# Altium project JST_LED.PrjPcb
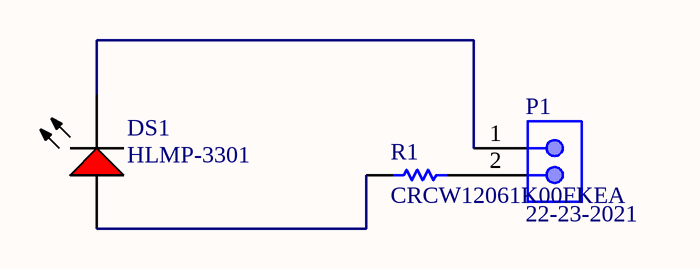
[diagram p0: JST_LED.SchDoc]
1 sheet, 3 parts. Net scope: global (net labels, ports and power ports of the same name join across sheets).
Board file: JST_LED.PcbDoc

## Sheet JST_LED.SchDoc
size A4

### Parts
DS1  HLMP-3301  [AVAG-HLMP-3301-2]
P1  22-23-2021  [MOLX-22-23-2021_V]
R1  CRCW12061K00FKEA  [RESC3216X60X45ML15T20]

### Nets
NetDS1_1: DS1.1(K) P1.1
NetDS1_2: DS1.2(A) R1.1
NetP1_2: P1.2 R1.2

### Library data of the parts
DS1 = CMP-2000-06411-1: T-1 3/4 (5 mm) Diffused LED Lamp, 1.9 V, -40 to 100 degC, 2-Pin THD, RoHS, Bulk; Manufacturer: Avago; Forward Current: 25mA; Forward Voltage: 2.4V; Peak Wavelength: 635nm; Shape Type: Circular; High Brightness: No; Main Category: StandardLED; Test Current (It): 10mA; Dominant Wave Length: 626nm; Number of  Elements: 1; Reverse Voltage: 5V; Chip Material: GaP; Product Height (mm): 9.19mm; Lens Type: ColoredDiffused; Viewing Angle: 60deg; Type: Uni-Color; Emitting Color: Red; Luminous Intensity: 5.4mcd; Power Dissipation: 85W; DELETED: Compliant; Product Depth (mm): 6.1mm; Package Description: 2-Pin Through Hole LED, Dia 5.85 mm; Mounting Technology: ThroughHole; Manufacturer URL: http://www.avagotech.com/; Package Type: T-13/4; Operating Temp Range: -40Cto100C; Datasheet URL: http://www.avagotech.com/docs/AV02-1558EN; Mounting: ThroughHole; Lens Dimensions: 5.08x5.08x8.3mm; Package Reference: HLMP-3301; Datasheet Version: 03/2015; Pin Count: 2; Packaging: TapeandReel; Operating Temperature Classification: Industrial; Lum Intensity: 5.4mcd; Rad Hardened: No; Product Length (mm): 6.1mm
P1 = CMP-1704-00001-3: Male Header, Pitch 2.54 mm, 1 x 2 Position, Height 10.67 mm, Tail Length 3.56 mm, 0 to 75 degC, RoHS, Bulk; Package Quantity: 3000; Height: 10.67 mm; RoHSCompliant: True; ComponentLink2URL: https://datasheet.ciiva.com/19454/232266-19454304.pdf; PartNumber: 22-23-2021; Packaging: Bulk; ComponentLink2Description: Datasheet; Min Operating Temperature: 0 degC; ComponentLink1Description: Manufacturer URL; Length: 5.08 mm; Mounting Technology: Through Hole; Max Operating Temperature: 75 degC; REACH SVHC: Unknown; PackageDescription: Male Header, Pitch 2.54 mm, 1 x 2 Position, Height 10.67 mm, Tail Length 3.56 mm; ComponentLink1URL: http://www.molex.com/; Mount: Through Hole; Radiation Hardening: No; Width: 6.35 mm; Pins: 2
R1 = CMP-2100-03616-1: Chip Resistor, 1 KOhm, +/- 1%, 0.25 W, -55 to 155 degC, 1206 (3216 Metric), RoHS, Tape and Reel; Manufacturer: Vishay Semiconductor; Power Rating: 250mW; Voltage Rating (DC): 200V; Resistance: 1KOhm; Temperature Coefficient: 100ppm/degreesC; Case Code (Imperial): 1206; Length: 3.2mm; Case/Package: 1206; Contact Plating: Tin; Package Quantity: 10; Datasheet URL: http://www.farnell.com/datasheets/1720486.pdf; Mount: SurfaceMount; Package Description: 2-Pin Surface Mount Device, Body 3.15 x 1.6 mm; Package Reference: 1206.0; Max Operating Temperature: 155degC; Lead Free: LeadFree; Weight: 0.000353oz; Military Standard: Not; Max Power Dissipation: 250mW; Case Code (Metric): 3216; Number of Terminations: 2; Tolerance: 1%; Width: 0.063inch; Termination: SMD/SMT; Number of Pins: 2; Min Operating Temperature: -55degC; Height: 0.55mm; Depth: 1.6mm; RoHSCompliant: true; Composition: ThickFilm; Packaging: TapeandReel; Manufacturer URL: http://www.vishay.com/; Voltage Rating: 200V; Radiation Hardening: No; REACH SVHC: Unknown; Datasheet Version: 41061.0